# EasyEDA Pro project ProPrj_H750VB_2024-10-16.epro, board PCB1
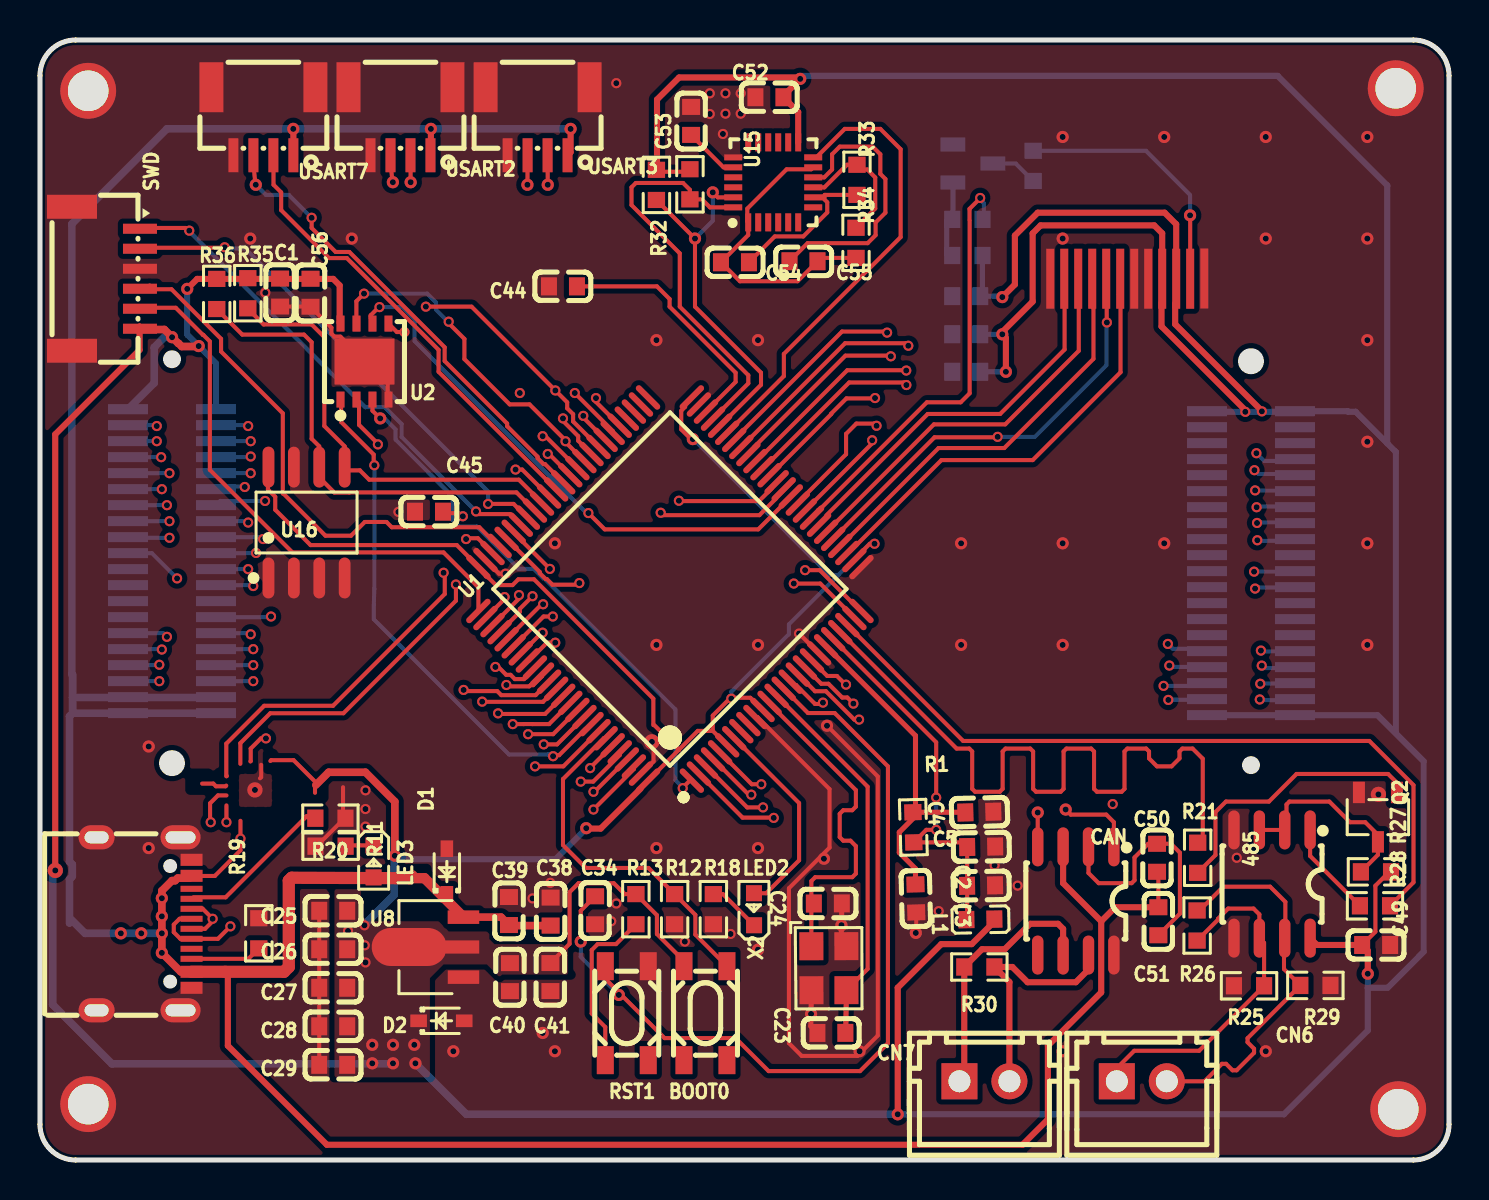
[diagram p2: board, top side]
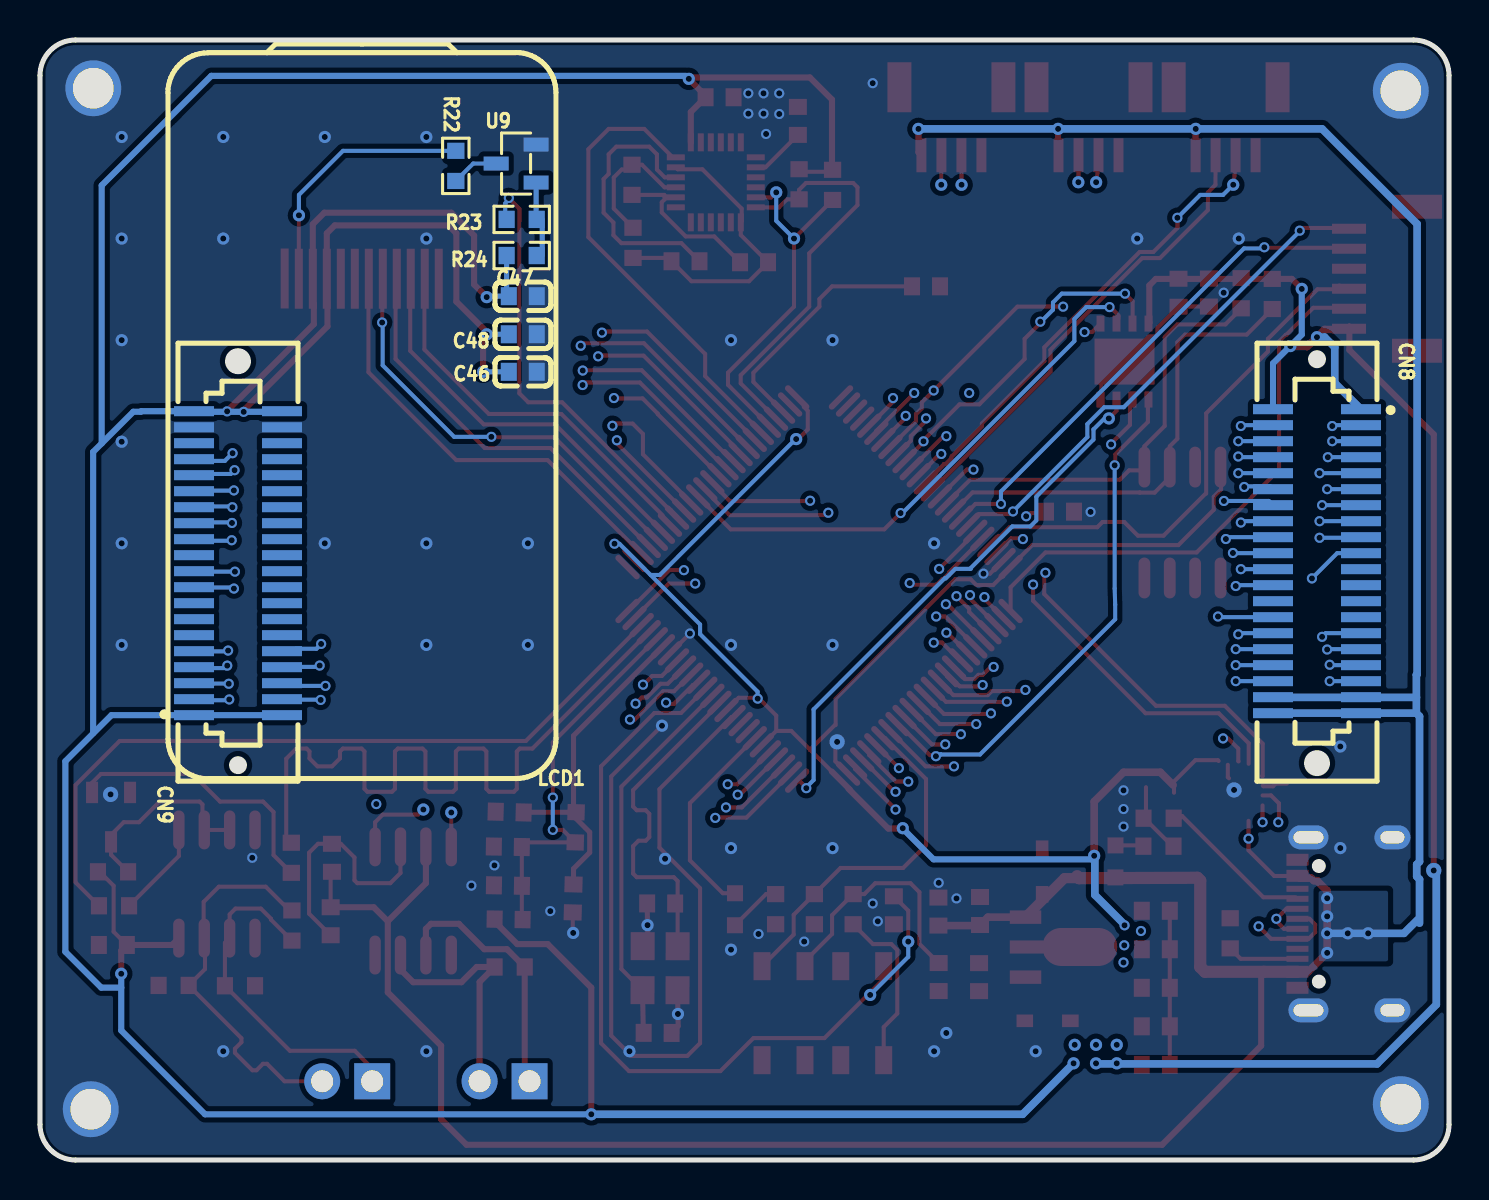
[diagram p3: board, bottom side, seen from below]

Outline 70.49 x 56.01 mm; copper layers: Top Layer, Inner1, Inner2, Bottom Layer. Coordinates in mm from the lower left corner of the outline.
Outline path: 0,54.23 0,1.78 arc(0.52,0.52) 1.78,0 68.71,0 arc(69.96,0.52) 70.49,1.78 70.49,54.23 arc(69.96,55.49) 68.71,56.01 1.78,56.01 arc(0.52,55.49) 0,54.23
Stack: Top Layer 0.035mm 外层铜厚1oz / Dielectric1 0.2104mm 7628 RC49% 8.6mil / Inner1 0.0152mm 内层铜厚 / Dielectric2 1.065mm 1.1mm H/HOZ Copper / Inner2 0.0152mm 内层铜厚 / Dielectric3 0.2104mm 7628 RC49% 8.6mil / Bottom Layer 0.035mm 外层铜厚1oz

## Design rules (mm)
template: 自定义配置
spacing copperThickness1oz (default): track to track 0.102, other pairs 0.152 to 0.3
spacing copperThickness2oz: track to track 0.203, other pairs 0.152 to 0.3
track width copperThickness1oz (default): min 0.127, default 0.203, max 2.54
track width copperThickness2oz: min 0.203, default 0.254, max 2.54
differential pair differentialPair (default): width min 0.127, default 0.254, max 2.54; gap min 0.152, default 0.152
via viaSize (default): diameter min 0.5, default 0.61, max 10; hole min 0.3, default 0.305, max 6.299
net 3.3V uses copperRegion1
net GND uses copperRegion1
net +5V uses copperRegion1

## Placement (name value [footprint] x y rotation side)
485  SP3485EN-L/TR  [SOIC-8_L5.0-W4.0-P1.27-LS6.0-BL]  61.63 13.8 180 top
BOOT0  TS-1145A-B-A  [SW-SMD_4P-L4.2-W3.2-P2.15-LS5.2]  33.29 7.34 180 top
C1  100nF  [C0603]  12.01 43.38 90 top
C2  100nF  [C0603]  47.08 15.66 181 top
C3  100nF  [C0603]  47.08 13.72 181 top
C4  100nF  [C0603]  46.99 17.4 181.5 top
C5  100nF  [C0603]  43.81 13.08 91.5 top
C23  22pf  [C0603]  39.59 6.36 0.1 top
C24  22pf  [C0603]  39.41 12.83 180.1 top
C25  100nF  [C0603]  14.67 12.46 0 top
C26  100nF  [C0603]  14.67 10.54 0 top
C27  100nF  [C0603]  14.67 8.61 0 top
C28  100nF  [C0603]  14.67 6.69 0 top
C29  4.7uF  [C0603]  14.67 4.76 0 top
C34  100nF  [C0603]  27.77 12.49 90 top
C38  100nF  [C0603]  25.54 12.42 270 top
C39  100nF  [C0603]  23.46 12.45 270 top
C40  100nF  [C0603]  23.51 9.15 90 top
C41  10uF  [C0603]  25.53 9.15 90 top
C44  2.2uF  [C0603]  26.16 43.69 0 top
C45  2.2uF  [C0603]  19.46 32.42 0 top
C46  100nF  [C0603]  46.33 39.42 0 bottom
C47  100nF  [C0603]  46.33 43.2 0 bottom
C48  100nF  [C0603]  46.33 41.29 0 bottom
C49  100nF  [C0603]  66.84 10.75 0 top
C50  100nF  [C0603]  55.88 15.11 90 top
C51  10uF  [C0603]  55.94 11.94 90 top
C52  100nF  [C0603]  36.49 53.14 0 top
C53  2.2nF  [C0603]  32.57 51.96 90 top
C54  100nF  [C0603]  34.76 44.89 180 top
C55  100nF  [C0603]  38.19 44.94 180 top
C56  100nF  [C0603]  13.53 43.37 90 top
CAN  TJA1050T/CM,118  [SOIC-8_L5.0-W4.0-P1.27-LS6.0-BL]  51.82 12.95 180 top
CN6  ZX-XH2.54-2PZZ  [CONN-TH_2P-P2.50_HX25003-2A]  55.12 3.94 0 top
CN7  ZX-XH2.54-2PZZ  [CONN-TH_2P-P2.50_HX25003-2A]  47.24 3.94 0 top
CN8  X0802WVS-40AS-LPV01  [CONN-SMD_40P-P0.80_XKB_X0802WVS-40ADS-LPV01]  6.6 29.95 270 bottom
CN9  X0802WVS-40AS-LPV01  [CONN-SMD_40P-P0.80_XKB_X0802WVS-40ADS-LPV01]  60.58 29.84 90 bottom
D1  CESD5V0D3  [SOD-323_L1.7-W1.3-LS2.6-RD-2]  20.35 14.43 90 top
D2  CESD5V0D3  [SOD-323_L1.7-W1.3-LS2.6-RD-2]  20.08 6.96 0 top
L1  BLM18SG331TN1D-300Ω100MHz  [L0603]  47.04 12.03 181 top
LCD1  1.47寸 IPS 172*320  [1.47LCD-IPS-172*320-反面]  54.36 43.82 0 bottom
LED2  -  [LED_0603]  35.71 12.59 90 top
LED3  -  [LED_0603]  16.69 14.88 270 top
NOREF  -  [Pad_e879]  2.41 2.79 0 top
NOREF#2  -  [Pad_e875]  67.94 2.54 0 top
NOREF#3  -  [Pad_e877]  67.82 53.59 0 top
NOREF#4  -  [Pad_e878]  2.41 53.47 0 top
Q2  S8050  [SOT-23-3_L2.9-W1.6-P1.90-LS2.8-BR]  66.93 17.15 90 top
R1  0  [R0603]  43.69 16.64 271.5 top
R11  10K  [R0603]  14.53 15.69 0 top
R12  10K  [R0603]  31.75 12.54 90 top
R13  10K  [R0603]  29.81 12.54 90 top
R18  10K  [R0603]  33.69 12.54 90 top
R19  5.1k  [R0603]  10.95 11.34 90 top
R20  5.1k  [R0603]  14.53 17.09 180 top
R21  5.1K  [R0603]  57.91 15.11 90 top
R22  20  [R0603]  49.68 49.71 90 bottom
R23  1K  [R0603]  46.39 47.04 180 bottom
R24  10K  [R0603]  46.39 45.23 180 bottom
R25  5.1K  [R0603]  60.48 8.71 0 top
R26  120  [R0603]  57.88 11.73 90 top
R27  5.1K  [R0603]  66.83 14.41 180 top
R28  1K  [R0603]  66.78 12.71 0 top
R29  5.1K  [R0603]  63.8 8.73 0 top
R30  120  [R0603]  46.99 9.65 0 top
R31  5.1k  [R0603]  32.51 48.79 90 top
R32  5.1k  [R0603]  30.84 48.76 90 top
R33  5.1k  [R0603]  40.87 49.02 270 top
R34  5.1k  [R0603]  40.82 45.86 270 top
R35  5.1k  [R0603]  10.4 43.34 270 top
R36  5.1k  [R0603]  8.84 43.31 270 top
RST1  TS-1145A-B-A  [SW-SMD_4P-L4.2-W3.2-P2.15-LS5.2]  29.35 7.34 180 top
SWD  swd  [CONN-SMD_6P-P1.00_MEGASTAR_ZX-SH1.0-6PWT]  3.3 44.07 270 top
U1  STM32H750VBT6  [LQFP-100_L14.0-W14.0-P0.50-LS16.0-BL]  31.51 28.55 45 top
U2  W25Q64JVXGIQ-QSPI  [XSON-8_L4.0-W4.0-P0.80-TL-EP]  16.23 39.93 90 top
U8  AMS1117-3.3  [SOT-89_L4.5-W2.5-P1.50-LS4.2-BR]  19.83 10.64 0 top
U9  SS8050  [SOT-23-3_L2.9-W1.3-P1.90-LS2.4-BR]  46.67 49.83 180 bottom
U15  MPU6050  [QFN-24_L4.0-W4.0-P0.50-BL]  36.68 48.89 0 top
U16  AT24C256C-SSHL-T  [SOIC-8_L4.9-W3.9-P1.27-LS6.0-BL]  13.33 31.88 0 top
USART2  WAFER-SH1.0-4PWB  [CONN-SMD_4P-P1.00_WAFER-SH1.0-4PWB]  18.03 51.94 180 top
USART3  WAFER-SH1.0-4PWB  [CONN-SMD_4P-P1.00_WAFER-SH1.0-4PWB]  24.89 51.94 180 top
USART7  WAFER-SH1.0-4PWB  [CONN-SMD_4P-P1.00_WAFER-SH1.0-4PWB]  11.18 51.94 180 top
USB1  TYPE-C 16PIN 2MD(073)  [USB-C-SMD_TYPE-C-6PIN-2MD-073]  5.21 11.81 270 top
X2  25MHz  [OSC-SMD_4P-L3.2-W2.5-BL]  39.47 9.59 270.1 top

## Footprints (pads in the part's own frame, mm; a bottom-side part is the same pattern mirrored in y, then rotated)
1.47LCD-IPS-172*320-反面
  rect 0.4x3 smd far side: 1(3.888,-0.266) 2(3.181,-0.254) 3(2.481,-0.254) 4(1.781,-0.254) 5(1.081,-0.254) 6(0.381,-0.254) 7(-0.319,-0.254) 8(-1.019,-0.254) 9(-1.719,-0.254) 10(-2.419,-0.254) 11(-3.119,-0.254) 12(-3.819,-0.254)
C0603
  rect 0.8x0.9 smd: 1(-0.7,0) 2(0.7,0)
CONN-SMD_4P-P1.00_WAFER-SH1.0-4PWB
  rect 0.5x1.7 smd: 1(-1.5,1.7) 2(-0.5,1.7) 3(0.5,1.7) 4(1.5,1.7)
  rect 1.2x2.5 smd: 5(-2.6,-1.7) 6(2.6,-1.7)
CONN-SMD_6P-P1.00_MEGASTAR_ZX-SH1.0-6PWT
  rect 0.5x1.7 smd: 1(-2.5,1.7) 2(-1.5,1.7) 3(-0.5,1.7) 4(0.5,1.7) 5(1.5,1.7) 6(2.5,1.7)
  rect 1.2x2.5 smd: 7(3.6,-1.7) 8(-3.6,-1.7)
CONN-SMD_40P-P0.80_XKB_X0802WVS-40ADS-LPV01
  rect 0.5x2 smd: 1(-7.6,2.2) 2(-7.6,-2.2) 3(-6.8,2.2) 4(-6.8,-2.2) 5(-6,2.2) 6(-6,-2.2) 7(-5.2,2.2) 8(-5.2,-2.2) 9(-4.4,2.2) 10(-4.4,-2.2) 11(-3.6,2.2) 12(-3.6,-2.2) 13(-2.8,2.2) 14(-2.8,-2.2) 15(-2,2.2) 16(-2,-2.2) 17(-1.2,2.2) 18(-1.2,-2.2) 19(-0.4,2.2) 20(-0.4,-2.2) 21(0.4,2.2) 22(0.4,-2.2) 23(1.2,2.2) 24(1.2,-2.2) 25(2,2.2) 26(2,-2.2) 27(2.8,2.2) 28(2.8,-2.2) 29(3.6,2.2) 30(3.6,-2.2) 31(4.4,2.2) 32(4.4,-2.2) 33(5.2,2.2) 34(5.2,-2.2) 35(6,2.2) 36(6,-2.2) 37(6.8,2.2) 38(6.8,-2.2) 39(7.6,2.2) 40(7.6,-2.2)
CONN-TH_2P-P2.50_HX25003-2A
  rect 1.8x1.8 hole 1.1: 1(-1.25,0)
  round 1.8 hole 1.1: 2(1.25,0)
L0603
  rect 0.8x0.864 smd: 1(-0.7,0) 2(0.7,0)
LED_0603
  rect 0.8x0.8 smd: 1(-0.851,-0.01) 2(0.75,-0.005)
LQFP-100_L14.0-W14.0-P0.50-LS16.0-BL
  oval 0.3x1.6 smd: 1(-6,-7.55) 2(-5.5,-7.55) 3(-5,-7.55) 4(-4.5,-7.55) 5(-4,-7.55) 6(-3.5,-7.55) 7(-3,-7.55) 8(-2.5,-7.55) 9(-2,-7.55) 10(-1.5,-7.55) 11(-1,-7.55) 12(-0.5,-7.55) 13(0,-7.55) 14(0.5,-7.55) 15(1,-7.55) 16(1.5,-7.55) 17(2,-7.55) 18(2.5,-7.55) 19(3,-7.55) 20(3.5,-7.55) 21(4,-7.55) 22(4.5,-7.55) 23(5,-7.55) 24(5.5,-7.55) 25(6,-7.55) 51(6,7.55) 52(5.5,7.55) 53(5,7.55) 54(4.5,7.55) 55(4,7.55) 56(3.5,7.55) 57(3,7.55) 58(2.5,7.55) 59(2,7.55) 60(1.5,7.55) 61(1,7.55) 62(0.5,7.55) 63(0,7.55) 64(-0.5,7.55) 65(-1,7.55) 66(-1.5,7.55) 67(-2,7.55) 68(-2.5,7.55) 69(-3,7.55) 70(-3.5,7.55) 71(-4,7.55) 72(-4.5,7.55) 73(-5,7.55) 74(-5.5,7.55) 75(-6,7.55)
  oval 1.6x0.3 smd: 26(7.55,-6) 27(7.55,-5.5) 28(7.55,-5) 29(7.55,-4.5) 30(7.55,-4) 31(7.55,-3.5) 32(7.55,-3) 33(7.55,-2.5) 34(7.55,-2) 35(7.55,-1.5) 36(7.55,-1) 37(7.55,-0.5) 38(7.55,0) 39(7.55,0.5) 40(7.55,1) 41(7.55,1.5) 42(7.55,2) 43(7.55,2.5) 44(7.55,3) 45(7.55,3.5) 46(7.55,4) 47(7.55,4.5) 48(7.55,5) 49(7.55,5.5) 50(7.55,6) 76(-7.55,6) 77(-7.55,5.5) 78(-7.55,5) 79(-7.55,4.5) 80(-7.55,4) 81(-7.55,3.5) 82(-7.55,3) 83(-7.55,2.5) 84(-7.55,2) 85(-7.55,1.5) 86(-7.55,1) 87(-7.55,0.5) 88(-7.55,0) 89(-7.55,-0.5) 90(-7.55,-1) 91(-7.55,-1.5) 92(-7.55,-2) 93(-7.55,-2.5) 94(-7.55,-3) 95(-7.55,-3.5) 96(-7.55,-4) 97(-7.55,-4.5) 98(-7.55,-5) 99(-7.55,-5.5) 100(-7.55,-6)
OSC-SMD_4P-L3.2-W2.5-BL
  rect 1.4x1.2 smd: 1(-1.1,-0.875) 2(1.1,-0.875) 3(1.1,0.875) 4(-1.1,0.875)
Pad_e875
  round 2.794 hole 2.032: 1(0,0)
Pad_e877
  round 2.794 hole 2.032: 1(0,0)
Pad_e878
  round 2.794 hole 2.032: 1(0,0)
Pad_e879
  round 2.794 hole 2.032: 1(0,0)
QFN-24_L4.0-W4.0-P0.50-BL
  rect 0.3x0.9 smd: 1(-1.25,-2) 2(-0.75,-2) 3(-0.25,-2) 4(0.25,-2) 5(0.75,-2) 6(1.25,-2) 13(1.25,2) 14(0.75,2) 15(0.25,2) 16(-0.25,2) 17(-0.75,2) 18(-1.25,2)
  rect 0.9x0.3 smd: 7(2,-1.25) 8(2,-0.75) 9(2,-0.25) 10(2,0.25) 11(2,0.75) 12(2,1.25) 19(-2,1.25) 20(-2,0.75) 21(-2,0.25) 22(-2,-0.25) 23(-2,-0.75) 24(-2,-1.25)
R0603
  rect 0.806x0.864 smd: 1(-0.753,0) 2(0.753,0)
SOD-323_L1.7-W1.3-LS2.6-RD-2
  rect 0.83x0.63 smd: 1(-1.14,0) 2(1.14,0)
SOIC-8_L4.9-W3.9-P1.27-LS6.0-BL
  oval 0.588x2.045 smd: 1(-1.905,-2.772) 2(-0.635,-2.772) 3(0.635,-2.772) 4(1.905,-2.772) 5(1.905,2.772) 6(0.635,2.772) 7(-0.635,2.772) 8(-1.905,2.772)
SOIC-8_L5.0-W4.0-P1.27-LS6.0-BL
  oval 0.569x1.95 smd: 1(-1.905,-2.705) 2(-0.635,-2.705) 3(0.635,-2.705) 4(1.905,-2.705) 5(1.905,2.705) 6(0.635,2.705) 7(-0.635,2.705) 8(-1.905,2.705)
SOT-23-3_L2.9-W1.3-P1.90-LS2.4-BR
  rect 1.25x0.7 smd: 1(1,-0.95) 2(1,0.95) 3(-1,0)
SOT-23-3_L2.9-W1.6-P1.90-LS2.8-BR
  rect 1.07x0.6 smd: 1(1.235,-0.95) 2(1.235,0.95) 3(-1.235,0)
SOT-89_L4.5-W2.5-P1.50-LS4.2-BR
  rect 1.575x0.672 smd: 1(1.356,-1.5) 3(1.356,1.5)
  custom 5.377x1.9 smd: 2(-1.356,0.009)
SW-SMD_4P-L4.2-W3.2-P2.15-LS5.2
  rect 0.85x1.4 smd: 1(1.075,2.35) 2(1.075,-2.35) 3(-1.075,2.35) 4(-1.075,-2.35)
USB-C-SMD_TYPE-C-6PIN-2MD-073
  rect 0.6x1.1 smd: 1(-3.2,2.375) 2(-2.4,2.375) 11(2.4,2.375) 12(3.2,2.375)
  rect 0.3x1.1 smd: 3(-1.75,2.375) 4(-1.25,2.375) 5(-0.75,2.375) 6(-0.25,2.375) 7(0.25,2.375) 8(0.75,2.375) 9(1.25,2.375) 10(1.75,2.375)
  oval 1.2x2 hole 0.6x1.5: 13(-4.325,1.825) 14(4.325,1.825)
  oval 1.2x1.8 hole 0.6x1.2: 13(-4.325,-2.375) 14(4.325,-2.375)
XSON-8_L4.0-W4.0-P0.80-TL-EP
  rect 0.8x0.4 smd: 1(-1.9,1.2) 2(-1.9,0.4) 3(-1.9,-0.4) 4(-1.9,-1.2) 5(1.9,-1.2) 6(1.9,-0.4) 7(1.9,0.4) 8(1.9,1.2)
  rect 2.3x3 smd: 9(0,0)

## Nets
As in the schematic, except:
GND: 485.4 485.5 C1.1 C2.1 C3.1 C4.1 C5.1 C23.1 C24.1 C25.1 C26.1 C27.1 C28.1 C29.1 C34.1 C38.1 C39.1 C40.1 C41.1 C44.1 C45.1 C46.1 C47.1 C48.1 C49.2 C52.1 C53.2 C56.1 CAN.8 CN9.37 CN9.38 D1.2 D2.2 LCD1.1 LCD1.5 LCD1.6 LCD1.12 NOREF.1 NOREF#2.1 NOREF#3.1 NOREF#4.1 Q2.2 R11.1 R12.1 R18.1 R19.2 R20.1 R25.1 R29.2 RST1.4 SWD.3 SWD.7 SWD.8 U1.10 U1.19 U1.26 U1.49 U1.74 U1.99 U2.4 U2.9 U8.1 U9.2 U15.19 U16.1 U16.2 U16.3 U16.4 U16.7 USART2.4 USART2.5 USART2.6 USART3.4 USART3.5 USART3.6 USART7.4 USART7.5 USART7.6 USB1.1 USB1.12 USB1.13 USB1.14 X2.2 X2.4
CAN_RX: CAN.4 U1.70 USB1.5 USB1.7
CAN_TX: CAN.1 U1.71 USB1.6 USB1.8

Pads without a net: BOOT0 1 3; CAN 5; RST1 3; U15 2 3 4 5 6 7 14 15 16 17 18 21 22; USB1 3 9

## Via types
v1: diameter 0.61, hole 0.305, Top Layer to Bottom Layer, 79 vias
v2: diameter 0.508, hole 0.305, Top Layer to Bottom Layer, 161 vias
v3: diameter 0.762, hole 0.305, Top Layer to Bottom Layer, 4 vias

## Routing (per net, layer and track width the routed paths; a pad name or vN(x,y) marks a point on that pad's centre or on a via; arc(x,y) is an arc through that point)
3.3V: length 413.5
  Top Layer w0.203: 21.64,29.96 20.85,30.75 13.54,30.75 11.77,32.52 11.77,33.17 11.4,33.53 11.4,34.43 ; U1.6 33.66,21.46 ; 33.66,21.46 33.66,22.23 34.54,23.11 35.53,23.11 U1.11 ; 33.66,21.46 32.9,21.46 31.96,20.51 ; 11.53,19.95 11.57,19.99 12.69,19.99 13.76,18.92 ; 31.96,20.51 31.97,20.51 ; 31.96,20.51 U1.100 ; 31.96,20.51 30.7,21.77 ; 32.27,37.75 32.27,37.66 32.08,37.47 32.08,36.53 32.56,36.05 ; 30.68,21.75 30.68,23.07 24.71,29.04 23.93,29.04 23.64,28.75 22.81,28.75 22.37,29.18 22.3,29.18 ; 4.99,41.73 4.99,41.61 ; 30.86,49.42 32.58,49.42 32.61,49.39 ; C49.1 66.8,11.42 66.8,13.72 67.5,14.41 R27.1 ; 41.12,30.42 41.51,30.82 v2(41.75,30.82) ; 38,54.03 38.06,53.97 ; BOOT0.2 32.22,9.95 30.86,11.3 30.86,12.24 R13.2 29.25,13.3 28.7,13.84 26.94,13.84 26.49,13.39 26.49,10.81 25.53,9.85 ; 13.76,18.37 13.76,18.75 ; 4.98,41.53 4.98,41.73
  Top Layer w0.305: C52.2 37.93,52.41 37.93,50.89 ; v1(42.91,2.29) 42.91,8.62 45.09,10.8 46.61,10.8 47.74,11.93 L1.1 ; v1(48.14,43.15) 48.77,43.78 48.77,46.23 49.91,47.37 56.26,47.37 56.84,46.8 LCD1.3 ; v3(0.77,14.48) 0.76,14.48 0.76,36.29 4.98,40.51 4.98,41.53 ; 30.04,18.57 28.05,16.57 27.27,16.57 ; 30.87,49.6 30.87,53.03 31.97,54.13 37.89,54.13 38,54.03 37.42,53.44 37.41,53.44 ; v1(7.37,43.56) 7.87,44.06 R36.1 14.67,44.06 14.99,43.73 14.99,41.87 U2.8 ; v1(48.32,39.42) 48.32,41.11 v1(48.14,41.29) 48.14,41.41 49.66,42.93 49.66,46.34 50.05,46.74 55.74,46.74 56.14,46.34 LCD1.4 ; 485.8 63.88,10.75 C49.1 66.42,10.47 v1(66.42,9.31) ; 61.13,37.45 56.79,41.79 56.79,42.83 ; 56.1,42.84 56.1,41.68 60.34,37.44
  Top Layer w0.381: v1(7.94,40.7) 7.92,40.68 7.09,40.68 6.93,40.84 6.91,40.84 v1(6.61,41.15) 6.22,41.53 4.87,41.53 ; v1(17.75,15.21) 17.75,17.92 16.28,19.39 14.44,19.39 13.8,18.75
  Bottom Layer w0.203: v2(41.75,30.82) 41.5,30.82 37.47,26.78 37.47,26.3 34.59,23.42 34.59,23.02 ; 39.93,29.25 39.48,29.25 32.74,35.99
  Bottom Layer w0.254: R24.1 47.14,43.31 C47.2 ; v1(48.14,41.29) 48.14,41.29 47.16,41.29 ; v1(48.14,43.15) 48.09,43.2 47.16,43.2 ; 47.16,39.42 v1(48.32,39.42)
  Bottom Layer w0.305: 66.42,8.62 67.42,8.62 69.22,10.41 69.22,19.94 66.91,22.25 CN9.1 CN9.2 ; 66.42,8.62 v1(66.42,9.31) ; 66.42,8.62 66.42,6.48 62.23,2.29 v1(42.91,2.29) ; 17.85,15.07 17.89,15.04 25.79,15.04 27.29,16.54 ; v1(7.37,43.56) 7.37,41.28 v1(7.94,40.7) 8.8,39.84 CN8.2 ; 67.4,35.84 65.82,37.42 65.44,37.42 65.41,37.45 63.34,37.45 ; 67.4,35.84 67.4,48.73 61.92,54.21 38.17,54.21 ; 67.4,35.84 67.83,35.41 67.83,21.34 ; 62.45,37.38 62.42,37.42 59.08,37.42 ; 38.21,54.17 38.05,54.01
  Bottom Layer w0.381: 16.25,11.78 17.72,13.26 17.72,15.26 ; CN8.1 5.72,38.86 5.72,40.64 6.22,41.15 6.35,41.15 ; v1(42.91,2.29) 21.33,2.29 v1(18.78,4.83) ; 17.67,4.81 3.6,4.81 0.64,7.77 0.64,14.35 v3(0.77,14.48)
  vias: v1(16.62,5.76) v1(16.62,4.83) v1(17.66,5.76) v1(17.66,4.83) v1(18.72,5.76) v1(27.33,16.59) v1(32.66,36.05) v1(38.03,54.06) v2(15.41,11.45) v2(16.23,11.74) v2(16.25,10.74) v2(16.28,9.88) v2(34.58,23.07) v2(60.29,37.41) v2(61.12,37.44)
+5V: length 194.8
  Top Layer w0.203: 10.03,16.96 v2(10.03,16.07) 10.03,15.49 8.75,14.2 7.76,14.2 ; 10.53,19.93 10.54,19.95 10.54,20.57 11.05,21.08 v2(11.3,21.08) ; C50.1 55.94,14.35 C51.2
  Top Layer w0.305: C51.2 53.79,12.64 53.09,11.94 ; USART2.1 19.56,50.26 v1(19.56,51.56) ; 53.09,11.94 51.18,13.84 CAN.3 ; 53.09,11.94 53.09,8.38 50.42,5.72 50.42,2.03 49.15,0.76 14.35,0.76 9.4,5.72 9.4,9.28 9.27,9.41 ; USART7.1 12.68,51.56 v1(12.67,51.56) ; USART3.1 26.54,50.39 v1(26.54,51.56)
  Top Layer w0.381: C38.2 23.49,11.72 C39.2 23.07,12.14 21.18,12.14 ; USB1.2 7.47,14.1 6.89,14.1 6.76,13.97 6.6,13.97 6.1,13.46 v1(6.1,13.09) v1(6.1,12.18) v1(6.1,11.34) v1(6.1,10.36) 7.04,9.41 USB1.11
  Top Layer w0.508: 18.6,14.09 19.24,14.09 21.18,12.14
  Top Layer w0.61: 18.6,14.19 18.5,14.09 12.59,14.11 12.45,13.97 12.45,9.65 12.2,9.41 USB1.11
  Inner1 w0.203: v2(11.3,21.08) 11.39,21 11.39,17.43 v2(10.03,16.07)
  Bottom Layer w0.381: 1.48,11.84 1.48,14.04 1.62,14.18 1.62,14.78 1.48,14.92 1.48,22.19 1.63,22.34 ; v1(6.1,11.34) v1(5.07,11.34) v1(4.05,11.34) 2.25,11.34 1.59,12 ; 1.63,22.34 CN8.39 CN8.40 ; 1.63,22.34 1.63,23.13 ; 1.63,23.13 1.63,24.26 1.62,24.28 ; 1.63,23.13 8.79,23.13 CN8.38 ; 1.6,24.28 1.6,46.81 6.35,51.56 v1(12.67,51.56) v1(19.56,51.56) v1(26.54,51.56)
GND: length 71
  Top Layer w0.203: 37.96,26.3 38,26.3 38.84,25.46 ; 35.79,22.15 35.89,22.15 39.5,18.55 39.5,15.62 37.47,13.59 37.47,5.84 38.1,5.21 40.89,5.21 41.91,6.22 41.91,19.18 v1(39.37,21.72) ; 22.66,29.62 22.96,29.32 v2(23.29,29.32) ; 43.83,12.38 43.83,11.18 ; 11.06,19.76 11.06,19.15 11.01,19.09 ; 12.01,42.68 13.52,42.68 C56.1 14.58,41.62 14.58,41.32 14.73,41.17 15.03,41.17 16.23,39.97 U2.9 ; 30.5,19.74 30.7,19.93 30.7,20.83 ; 17.4,38.12 17.4,39.09 17.48,39.18 ; C29.1 C28.1 C27.1 C26.1 C25.1 ; 13.89,15.74 15.16,17.01 ; 15.16,17.01 15.16,16.99 15.28,16.87 ; 15.16,17.01 15.16,18.64
  Top Layer w0.254: X2.4 40.08,10.96 v1(40.09,11.74) C24.1 ; X2.2 v1(38.57,7.3) 38.56,6.69 38.89,6.35
  Inner1 w0.203: v1(10.52,46.08) 11.27,45.32 v2(11.27,43.37)
  vias: v1(5.44,20.68) v1(5.44,15.6) v1(15.6,46.08) v1(20.68,5.44) v1(25.15,6.35) v1(25.76,30.84) v1(25.76,5.44) v1(30.84,41) v1(30.84,25.76) v1(30.84,15.6) v1(35.92,41) v1(35.92,25.76) v1(35.92,15.6) v1(35.92,10.52) v1(39.22,15.06) v1(41,5.44) v1(43.81,11.36) v1(46.08,30.84) v1(46.08,25.76) v1(51.16,51.16) v1(51.16,46.08) v1(51.16,30.84) v1(51.16,25.76) v1(51.16,5.44) v1(56.24,51.16) v1(56.24,30.84) v1(61.32,51.16) v1(61.32,46.08) v1(61.32,5.44) v1(66.4,51.16) v1(66.4,46.08) v1(66.4,41) v1(66.4,35.92) v1(66.4,30.84) v1(66.4,25.76) v2(16.28,18.48) v2(16.28,17.55) v2(16.28,16.67) v2(17.93,32.41) v2(24.64,13.08) v2(25.53,13.86) v2(28.57,11.94) v2(28.83,53.85) v2(28.83,12.83) v2(32.26,10.92) v2(33.51,53.34) v2(33.51,52.31) v2(34.16,51.31) v2(34.29,53.34) v2(34.29,52.32) v2(34.54,11.3) v2(35.05,53.34) v2(35.05,52.32) v2(37.97,26.33) v2(44.96,12.45) v2(47.75,14.73) v2(48.9,13.72) v2(59.87,15.11) v3(10.75,18.51) v3(30.61,20.91) v3(66.95,18.28)
VDDA: length 19.5
  Top Layer w0.203: L1.2 46.38,12.06 C2.2 46.15,15.88 R1.2 44.33,16.51 v2(44.83,16.51) ; v2(44.83,18.12) 44.83,20.89 U1.21
  Bottom Layer w0.203: v2(44.83,16.51) v2(44.83,18.12)
485_UART4_RX: length 38.2
  Top Layer w0.203: U1.23 46.18,20.95 66.5,20.95 68.71,18.75 68.71,13.88 R28.2
485_UART4_TX: length 38.1
  Top Layer w0.203: R21.2 58.17,16.12 58.17,20.07 57.66,20.57 57.15,20.57 57,20.43 57,20.08 56.61,19.69 55.88,19.69 55.48,20.08 55.48,20.43 55.34,20.57 54.4,20.57 54.25,20.43 54.25,18.56 54.11,18.42 52.87,18.42 52.73,18.56 52.73,20.43 52.58,20.57 51.35,20.57 51.2,20.43 51.2,18.56 51.06,18.42 49.82,18.42 49.68,18.56 49.68,20.43 49.54,20.57 48.3,20.57 48.16,20.43 48.16,18.56 48.01,18.42 46.78,18.42 46.63,18.56 46.63,20.43 46.49,20.57 45.85,20.57 U1.22
BLK: length 21.1
  Top Layer w0.203: 47.01,48.07 46.5,47.56 46.5,47.01 ; 46.51,46.96 46.51,38.34 46.06,37.89 44.37,37.89 38.98,32.5 38.92,32.5
  Bottom Layer w0.203: 46.98,48.07 47.21,47.84 47.21,46.96
  vias: v2(47.03,48.11)
BOOT0: length 17.6
  Top Layer w0.203: BOOT0.4 32.78,11.27 32.78,12.26 R12.2 30.44,14.61 27.31,14.61 26.16,15.75 26.16,19.05 28.2,21.09 U1.94
CAN_RX: length 42.3
  Top Layer w0.203: 25.55,29.55 25.51,29.55 24.08,30.98 ; USB1.7 8.26,11.56 8.64,11.94 v2(8.64,12.06) 8.64,12.07 8.13,12.57 7.59,12.57 USB1.5 ; CAN.4 v1(49.91,17.38) ; 9.33,17.73 v2(9.33,16.89)
  Inner1 w0.203: v2(9.33,16.89) 9.33,12.75 v2(8.64,12.06) ; v1(49.91,17.38) 49.91,18.16 40.27,27.8 27.13,27.8 25.47,29.47
  vias: v2(25.51,29.56)
CAN_TX: length 49.1
  Top Layer w0.203: v2(8.54,16.89) 8.51,16.92 8.51,17.84 8.9,18.23 9.33,18.23 ; v2(9.53,11.68) 8.9,11.06 USB1.8 7.02,11.06 6.69,11.39 6.69,11.77 6.98,12.07 7.58,12.07 USB1.6 ; 23.8,30.61 25,29.41 25,29.35 25.3,29.05 25.35,29.05 25.63,28.77 27.03,28.77 ; v1(51.31,17.53) 51.56,17.27 53.34,17.27 53.72,16.89 CAN.1
  Inner1 w0.203: 26.99,28.85 27.52,28.32 40.52,28.32 v1(51.31,17.53)
  Inner2 w0.203: v2(9.53,11.68) 9.53,14.1 8.51,15.11 8.51,16.86 v2(8.54,16.89)
  vias: v2(26.98,28.85)
CS: length 19.9
  Top Layer w0.203: 53.33,42.81 53.36,42.78 53.36,41.92 ; v2(47.91,36.16) 47.88,36.14 44.75,36.14 40.06,31.45
  Bottom Layer w0.203: 53.34,41.98 53.34,39.74 49.77,36.16 v2(47.91,36.16)
  vias: v2(53.37,41.88)
DC: length 21.2
  Top Layer w0.203: 40.52,30.43 45.09,35 49.66,35 54.05,39.39 54.05,43.19 53.96,43.28
LEDK: length 13
  Top Layer w0.203: v1(57.53,47.24) 57.54,47.23 LCD1.2
  Bottom Layer w0.203: R22.2 55.33,50.46 57.53,48.26 v1(57.53,47.24)
LPUART1_RX: length 46
  Top Layer w0.203: v2(21.81,32.43) 21.94,32.3 23.51,32.3 23.91,31.9 ; 9.34,19.2 9.33,19.19 9.32,19.19 ; 5.11,46.61 7.29,46.61 7.45,46.45 ; v2(20.19,29.37) 20.25,29.31 20.25,28.3 14.66,22.71 11.21,22.71 9.32,20.82 9.32,19.27
  Inner2 w0.203: 20.15,29.4 20.15,30.77 21.07,31.68 21.36,31.68 21.66,31.98 21.66,32.28 21.87,32.49
  Bottom Layer w0.203: 7.49,46.42 16.27,37.64 17.25,37.64 18.09,36.8 18.09,36.15 v2(21.81,32.43) ; 7.48,46.42 7.44,46.39
  vias: v2(7.47,46.47)
LPUART1_TX: length 44.6
  Top Layer w0.203: v2(20.81,28.78) 20.81,27.97 15.18,22.34 11.52,22.34 10.02,20.84 10.02,19.81 ; 9.26,45.64 9.24,45.62 5.68,45.62 ; v2(22.41,32.81) 23.69,32.81 24.06,32.44
  Inner2 w0.203: 20.82,28.78 20.89,28.85 20.89,29.91 22.41,31.43 22.41,32.85
  Bottom Layer w0.203: 9.21,45.58 10.26,45.58 22.41,33.43 22.41,32.81
  vias: v2(9.24,45.64)
OSC_IN: length 17.1
  Top Layer w0.203: U1.12 36.5,22.81 40.81,18.5 40.81,17.67 40.63,17.49 40.18,17.49 40,17.31 40,16.15 40.18,15.97 40.54,15.97 40.81,15.7 40.81,14.32 40.63,14.14 38.78,14.14 38.59,13.95 X2.1
OSC_OUT: length 19.2
  Top Layer w0.203: X2.3 41.4,9.55 41.4,18.67 36.86,23.21
  Top Layer w0.254: X2.3 40.31,6.37 C23.2 ; 36.86,23.21 U1.13
PA2: length 33.2
  Top Layer w0.203: 40.47,27.35 40.47,27.39 39.03,28.83 v2(37.71,28.83) ; 17.53,50.24 arc(17.56,49.57) v1(17.65,48.9)
  Inner1 w0.203: 17.69,48.77 17.58,48.88 ; 17.74,48.82 17.85,48.82 17.94,48.73 17.94,48.7 18.31,48.34 18.32,48.34 37.69,28.96 37.83,28.96
PA3: length 32.4
  Top Layer w0.203: v2(38.27,29.5) 39.01,29.5 40.76,27.74 ; USART2.2 v1(18.54,48.9)
  Inner1 w0.203: 19.27,48.34 19.28,48.34 18.61,49 18.38,49 ; 19.28,48.33 22.07,45.74 38.25,29.55
PA5: length 18.7
  Top Layer w0.203: 40.45,31.1 44.95,35.6 48.24,35.6 52.7,40.06 52.7,42.6 52.56,42.74
PA7: length 18.1
  Top Layer w0.203: 39.68,31.75 44.72,36.79 48.29,36.79 51.96,40.46 51.96,42.66
PA8: length 23.2
  Top Layer w0.203: R36.2 10.12,41.28 13.21,41.28 13.59,40.89 13.59,36.07 13.97,35.69 U16.6 ; 13.81,34.29 14.73,33.37 15.47,33.37 15.48,33.38 23.84,33.38 24.51,32.71
PA13: length 25.7
  Top Layer w0.203: 12.2,33.3 14.28,31.22 15.56,31.22 16.25,31.9 17.33,31.9 17.6,31.64 21.98,31.64 22.69,30.93 ; 5.49,43.73 5.67,43.54 6.58,43.54 9.06,41.06 9.06,40.43 ; 12.15,33.32 12.15,37.34 9.06,40.43
PA14: length 27.1
  Top Layer w0.203: 5.55,42.62 6.79,42.62 8.15,41.26 8.17,41.26 8.5,40.93 8.5,34.51 12.63,30.38 20.19,30.38 21.93,28.64 U1.76
PA15: length 23.6
  Top Layer w0.203: U1.77 23.24,28.06 v2(23.24,28.15)
  Inner2 w0.203: v2(23.24,28.15) 21.38,26.29 19.94,26.29 16.89,23.24 9.27,23.24 v2(6.35,26.16)
  Bottom Layer w0.203: CN8.29 6.17,26.34 v2(6.35,26.16)
PB0: length 28
  Top Layer w0.203: v2(41.63,35.99) 41.63,35.84 38.73,32.94
  Inner1 w0.203: 60.78,28.65 59.91,28.65 54.64,33.92 47.17,33.92 45.08,36.01 41.71,36.01
  Bottom Layer w0.203: 60.81,28.57 60.86,28.63 62.37,28.63
  vias: v2(60.78,28.58)
PB1: length 29.6
  Top Layer w0.203: 38.1,33.06 40.32,35.29 40.32,36.31 40.84,36.83 41.74,36.83 v2(41.85,36.72)
  Inner1 w0.203: v2(60.73,29.42) 60.34,29.42 54.94,34.82 47.28,34.82 45.35,36.75 41.82,36.75
  Bottom Layer w0.203: 62.38,29.39 62.35,29.42 v2(60.73,29.42)
PB2: length 26.6
  Top Layer w0.203: v2(27.43,32.35) 28.25,31.54 35.93,31.54 37.17,32.77 ; 16.95,42.58 16.89,42.58 16.54,42.24 16.54,42.09
  Bottom Layer w0.203: 17.04,42.65 18.14,42.65 18.74,42.05 18.74,40.95 27.34,32.35 v2(27.43,32.35)
  vias: v2(16.98,42.65)
PB3: length 21.7
  Top Layer w0.203: v2(23.65,21.8) 24.2,21.8 24.21,21.8 24.63,21.8 24.63,21.8 25.47,21.8 U1.89
  Inner1 w0.203: v2(23.65,21.8) 20.11,21.8 11.55,30.36 v2(10.81,30.36)
  Bottom Layer w0.203: CN8.20 10.8,30.34
PB4: length 22
  Top Layer w0.203: v2(24.42,21.29) 25.67,21.29 U1.90
  Inner1 w0.203: v2(10.41,29.55) 11.48,29.55 19.73,21.29 24.41,21.29 v2(24.42,21.29)
  Bottom Layer w0.203: CN8.22 v2(10.41,29.55)
PB5: length 22.6
  Top Layer w0.203: U1.91 25.87,20.79 v2(25.2,20.79)
  Inner1 w0.203: v2(25.2,20.79) 24.86,20.45 19.81,20.45 12.32,27.94 11.43,27.94 v2(10.67,28.7)
  Bottom Layer w0.203: CN8.24 10.62,28.75 v2(10.67,28.7)
PB6: length 25.5
  Top Layer w0.203: v2(16.73,34.74) 16.69,34.77 16.69,35.28 15.06,36.91 15.06,38.1 ; 25.72,20.24 25.97,20.24 27.29,21.56
  Bottom Layer w0.203: 25.57,20.28 25.42,20.28 25.41,20.28 23.46,20.28 16.7,27.04 16.7,27.77 16.73,28.57 v2(16.73,34.74)
  vias: v2(25.67,20.19)
PB7: length 23
  Top Layer w0.203: v2(24.76,19.69) 26.18,19.69 U1.93
  Inner1 w0.203: v2(11.56,27.18) 12.32,27.18 19.81,19.69 v2(24.76,19.69)
  Bottom Layer w0.203: v2(11.56,27.18) 11.52,27.15 CN8.28
PB8: length 23.6
  Top Layer w0.203: U1.95 27.52,19.61 v2(27.52,19.6)
  Inner1 w0.203: v2(27.52,19.6) 27.01,19.6 26.46,19.05 19.69,19.05 12.45,26.29 v2(10.54,26.29)
  Bottom Layer w0.203: CN8.30 10.48,26.34 v2(10.54,26.29)
PB9: length 23.9
  Top Layer w0.203: v2(27.05,18.92) 27.68,18.92 29,20.25 29,20.38
  Inner1 w0.203: v2(27.05,18.92) 26.67,18.54 19.43,18.54 12.43,25.55 v2(10.67,25.55)
  Bottom Layer w0.203: CN8.32 v2(10.67,25.55)
PB10: length 18.1
  Top Layer w0.203: U15.23 33.9,48.14 v1(33.66,48.39) ; U1.46 36.07,38.76 36.07,39.37 32.77,42.67 v1(32.77,46.08) R32.1
  Bottom Layer w0.203: v1(33.66,48.39) 33.66,46.97 v1(32.77,46.08)
PB11: length 20.7
  Top Layer w0.203: U1.47 35.43,38.84 35.43,39.24 32,42.67 32,45.34 29.59,47.75 29.59,48.64 29.81,48.86 32.17,48.86 32.51,48.51 32.51,48.04 33.12,48.04 33.51,47.64 U15.24
PC0: length 26.9
  Top Layer w0.203: 39.17,22.8 38.77,22.8 37.82,23.75 37.79,23.75
  Inner2 w0.203: 39.22,22.94 40.74,21.41 52.9,21.41 55.71,24.22 60.41,24.22 60.86,24.66 61.16,24.66
  Bottom Layer w0.203: 62.31,24.6 61.18,24.6 61.11,24.66
  vias: v2(39.17,22.87) v2(61.12,24.72)
PC1: length 21.7
  Top Layer w0.203: v2(40.97,22.02) 40.73,22.02 39.32,23.44 38.77,23.44 38.36,23.85
  Inner2 w0.203: 56.42,24.64 55.11,24.64 52.57,22.11 41.14,22.11 40.99,21.96
  Bottom Layer w0.203: 58.19,24.66 56.52,24.66 56.45,24.72
  vias: v2(56.49,24.73)
PC2: length 25.2
  Top Layer w0.203: 38.71,24.19 39.08,23.81 39.44,23.81 40.13,23.13 40.39,23.13 v2(40.69,22.82)
  Inner2 w0.203: 61.26,25.25 54.99,25.25 52.57,22.83 40.75,22.83
  Bottom Layer w0.203: 61.1,25.43 62.24,25.43 62.27,25.41
  vias: v2(61.07,25.47)
PC3: length 20
  Top Layer w0.203: 39.02,24.63 39.02,24.56 39.38,24.2 39.87,24.2 40.3,23.77
  Inner2 w0.203: 40.33,23.78 52.26,23.78 54.21,25.73 56.35,25.73 v2(56.42,25.81)
  Bottom Layer w0.203: 57.7,25.56 56.66,25.56 56.42,25.8 v2(56.42,25.81)
  vias: v2(40.32,23.77)
PC4: length 17.6
  Top Layer w0.203: 39.33,32.23 44.41,37.31 48.03,37.31 51.25,40.53 51.25,42.81
PC6: length 23.8
  Top Layer w0.203: U1.63 25.26,34.8 25.19,34.8 24.89,35.1 24.89,35.17 23.37,36.7 23.37,36.83 20.24,39.95 20.24,40.64 15.48,45.41 14.79,45.41 13.59,46.61 v2(13.59,47.12) ; USART7.3 arc(10.71,49.5) v1(10.8,48.77)
  Bottom Layer w0.203: v2(13.59,47.12) 12.45,48.26 11.3,48.26 v1(10.8,48.77)
PC7: length 23.1
  Top Layer w0.203: 25.82,33.54 19.94,39.42 19.94,40.51 15.35,45.1 14.46,45.1 12.06,47.5 12.06,48.39 11.68,48.77 USART7.2
PC8: length 25.4
  Top Layer w0.203: U1.65 24.12,34.53 v2(23.79,34.53)
  Inner2 w0.203: v2(23.79,34.53) 22.7,34.53 15.98,27.81 8.13,27.81 v2(6.86,29.08)
  Bottom Layer w0.203: v2(6.86,29.08) 5.6,30.34 CN8.19
PC9: length 21.5
  Top Layer w0.203: 15.14,34.49 16,34.49 16.47,34.02 23.96,34.02 24.83,33.14 ; 10.67,42.55 10.67,42.3 11.19,41.78 13.59,41.78 14.22,41.15 14.22,36.7 15.24,35.69 U16.5
PC10: length 25.1
  Top Layer w0.203: 22.64,26.75 23.96,28.07 v2(23.96,28.25)
  Inner2 w0.203: v2(6.1,25.53) 8.89,22.73 17.14,22.73 20.32,25.91 21.72,25.91 23.96,28.15 v2(23.96,28.25)
  Bottom Layer w0.203: CN8.31 6.08,25.55 v2(6.1,25.53)
PC11: length 26.2
  Top Layer w0.203: v2(24.64,28.19) 24,27.56 24,27.41 U1.79
  Inner2 w0.203: v2(5.97,24.77) 8.51,22.23 17.65,22.23 20.96,25.53 21.97,25.53 v2(24.64,28.19)
  Bottom Layer w0.203: CN8.33 5.95,24.75 v2(5.97,24.77)
PC12: length 26.9
  Top Layer w0.203: U1.80 25.09,27.79 v2(25.17,27.79)
  Inner2 w0.203: v2(25.17,27.79) 25.12,27.79 22.35,25.02 21.34,25.02 18.03,21.72 8,21.72 5.97,23.75 v2(5.97,23.95)
  Bottom Layer w0.203: CN8.35 v2(5.97,23.95)
PC13: length 10.4
  Top Layer w0.203: U1.7 37.97,17.85 37.97,14.99 36.33,13.34 LED2.2
PD0: length 24.2
  Top Layer w0.203: U1.81 25.19,27.18 v2(25.65,27.18)
  Inner1 w0.203: v2(10.41,36.7) 11.43,36.7 21.97,26.16 24.13,26.16 25.15,27.18 v2(25.65,27.18)
  Bottom Layer w0.203: CN8.4 10.41,36.75
PD1: length 22.3
  Top Layer w0.203: v2(25.14,26.37) 25.1,26.37 24.06,25.33 24.05,25.33
  Inner1 w0.203: v2(10.54,35.95) 11.55,35.95 21.72,25.78 24.51,25.78 25.1,26.37 v2(25.14,26.37)
  Bottom Layer w0.203: CN8.6 v2(10.54,35.95)
PD2: length 23.4
  Top Layer w0.203: v2(25.78,25.87) 25.36,25.87 24.47,24.98 24.41,24.98
  Inner1 w0.203: v2(10.54,35.18) 11.66,35.18 21.41,25.43 23.47,25.43 24,24.89 24.41,24.89 25.39,25.87 v2(25.78,25.87)
  Bottom Layer w0.203: CN8.8 10.51,35.15 v2(10.54,35.18)
PD3: length 19.7
  Top Layer w0.203: 24.24,24.12 24.24,24.08 24.21,24.05 23.76,24.05 23.54,24.26 23.32,24.26 ; 23.32,24.27 22.88,24.71
  Inner1 w0.203: 22.78,24.65 21.57,24.65 11.88,34.34 v2(10.54,34.34)
  Bottom Layer w0.203: CN8.10 v2(10.54,34.34)
  vias: v2(22.78,24.66)
PD4: length 20.8
  Top Layer w0.203: U1.85 25.11,24.19 24.67,23.75 24.54,23.75 24.48,23.69 23.4,23.69 v2(23.33,23.75)
  Inner1 w0.203: v2(23.33,23.75) 22.96,23.75 22.76,23.96 21.51,23.96 11.81,33.66 v2(10.24,33.66)
  Bottom Layer w0.203: CN8.12 8.94,33.68 10.21,33.68 v2(10.24,33.66)
PD5: length 21.1
  Top Layer w0.203: U1.86 24.79,23.25 23.07,23.25 22.87,23.45 21.25,23.45 v2(21.19,23.51)
  Inner1 w0.203: v2(21.19,23.51) 21.07,23.51 11.62,32.96 v2(11.26,32.96)
  Bottom Layer w0.203: v2(11.26,32.96) 9.02,32.96 CN8.14
PD6: length 21.1
  Top Layer w0.203: v2(22.12,22.92) 22.13,22.91 25.16,22.91 25.82,23.57
  Inner1 w0.203: v2(10.41,31.88) 11.81,31.88 20.83,22.86 22.06,22.86 v2(22.12,22.92)
  Bottom Layer w0.203: v2(10.41,31.88) 10.35,31.95 CN8.16
PD7: length 21.4
  Top Layer w0.203: U1.88 25.27,22.31 22.94,22.31 v2(22.91,22.34)
  Inner1 w0.203: v2(22.91,22.34) 20.46,22.34 11.75,31.05 v2(11.16,31.05)
  Bottom Layer w0.203: CN8.18 11.07,31.15 v2(11.16,31.05)
PD8: length 27.5
  Top Layer w0.203: 29,36.72 27.81,37.91 v2(27.81,38.1)
  Inner1 w0.203: v2(5.84,36.7) 9.02,39.88 9.02,40.01 9.16,40.15 25.76,40.15 v2(27.81,38.1)
  Bottom Layer w0.203: CN8.3 5.67,36.75 5.72,36.7
PD9: length 27.2
  Top Layer w0.203: U1.56 28.65,36.46 v2(26.75,38.35)
  Inner1 w0.203: v2(5.84,35.95) 9.52,39.62 25.36,39.62 26.63,38.35 v2(26.75,38.35)
  Bottom Layer w0.203: CN8.5 v2(5.84,35.95)
PD10: length 26.8
  Top Layer w0.203: v2(27.18,37.21) 27.18,37.13 U1.57
  Inner1 w0.203: v2(27.18,37.21) 26.42,37.97 25.57,37.97 24.55,38.99 9.91,38.99 v2(6.06,35.15)
  Bottom Layer w0.203: CN8.7 v2(6.06,35.15)
PD11: length 37.7
  Top Layer w0.203: U2.5 17.86,41.4 v2(18.23,41.4) ; v2(19.3,42.67) 21.59,42.67 v2(25.78,38.48) 26.37,37.89 26.37,37.59 26.67,37.29 26.67,36.93 U1.58
  Inner1 w0.203: v2(18.23,41.4) 18.23,41.6 v2(19.3,42.67) ; v2(24,38.35) 10.49,38.35 v2(6.48,34.34)
  Inner2 w0.203: v2(24,38.35) 25.65,38.35 v2(25.78,38.48)
  Bottom Layer w0.203: CN8.9 v2(6.48,34.34)
PD12: length 31.8
  Top Layer w0.203: U1.59 26.92,35.97 26.92,36.2 26.16,36.96 v2(26.16,37.08) ; 16.94,35.79 16.93,35.79 15.96,36.76 15.96,37.92
  Inner2 w0.203: v2(6.1,33.55) 8.91,33.55 9.91,34.54 9.91,36.91 10.46,37.47 12.95,37.47 14.99,35.43 16.13,35.43 16.15,35.46 16.61,35.46 19,37.85 25.4,37.85 v2(26.16,37.08)
  Bottom Layer w0.203: CN8.11 v2(6.1,33.55)
  vias: v2(16.9,35.78)
PD13: length 40.9
  Top Layer w0.203: U1.60 26.29,35.9 ; 26.21,36.06 24.49,37.79 23.5,37.79 21.23,40.05 21.23,41.06 20.52,41.77 20.5,41.77 ; v2(16.21,43.32) 15.83,42.94 15.83,42.01
  Inner2 w0.203: v2(26.29,35.94) 24.89,37.34 22.86,37.34 19.18,33.66 11.05,33.66 10.21,32.82 6.42,32.82 v2(6.35,32.75)
  Bottom Layer w0.203: 20.43,41.9 19.81,42.52 19.81,42.88 19.37,43.32 16.14,43.32 ; CN8.13 v2(6.35,32.75)
  vias: v2(20.45,41.92)
PD14: length 25.1
  Top Layer w0.203: v2(25.15,36.2) 25.28,36.2 U1.61
  Inner2 w0.203: v2(25.15,36.2) 24.89,36.45 23.24,36.45 20.02,33.22 12.25,33.22 11.46,32.44 10.22,32.44 9.72,31.95 v2(6.48,31.95)
  Bottom Layer w0.203: CN8.15 v2(6.48,31.95)
PD15: length 24.3
  Top Layer w0.203: v2(25.4,35.31) 25.46,35.31 U1.62
  Inner2 w0.203: v2(6.48,31.12) 10.46,31.12 11.09,31.75 19.24,31.75 22.8,35.31 v2(25.4,35.31)
  Bottom Layer w0.203: v2(6.48,31.12) 5.03,31.12 5,31.15 CN8.17
PE0: length 24.2
  Top Layer w0.203: v2(27.69,18.42) 27.74,18.42 U1.97
  Inner1 w0.203: v2(10.67,24.75) 12.59,24.75 19.3,18.03 27.31,18.03 v2(27.69,18.42)
  Bottom Layer w0.203: CN8.34 v2(10.67,24.75)
PE1: length 24.5
  Top Layer w0.203: v2(27.69,17.53) 29.71,19.55 29.71,19.68
  Inner1 w0.203: v2(27.69,17.53) 19.06,17.53 12.64,23.95 v2(10.67,23.95)
  Bottom Layer w0.203: CN8.36 v2(10.67,23.95)
PE2: length 27.7
  Top Layer w0.203: 32.13,18.59 32.53,19 32.63,19 ; 16.63,38.03 16.63,37.47 v1(17.02,37.08)
  Bottom Layer w0.203: 23.96,29.56 21.84,31.68 20.94,31.68 20.65,31.98 20.65,33.17 17.79,36.03 17.79,36.53 17.07,37.25 ; 23.96,29.56 23.92,29.56 ; 23.96,29.56 24.69,29.56 25.18,29.08 ; 25.21,29.11 31.79,22.53 31.79,19 32.18,18.61 32.18,18.57
  vias: v2(32.15,18.59)
PE3: length 32.6
  Top Layer w0.203: 36.61,17.12 35.15,17.12 33.14,19.12
  Inner2 w0.203: v2(61.02,23.03) 54.81,16.82 49.68,16.82 49.48,17.02 36.78,17.02 36.7,17.1
  Bottom Layer w0.203: 62.32,23 62.32,22.99 61,22.99
  vias: v2(36.71,17.11)
PE4: length 29.3
  Top Layer w0.203: v2(36.17,17.63) 35.38,17.63 33.7,19.31
  Inner1 w0.203: 56.43,22.99 56.12,22.99 55.4,22.26 55.4,19.51 53.64,17.75
  Inner2 w0.203: 36.21,17.68 36.28,17.62 49.36,17.62 49.68,17.94 50.14,17.94 50.4,17.68 50.56,17.68 50.84,17.95 ; 50.83,17.97 50.97,17.97 51.08,18.09 51.54,18.09 51.83,17.8 v2(53.66,17.8)
  Bottom Layer w0.203: 56.44,23.02 57.95,23.02 57.98,23.05
  vias: v2(56.44,23.01)
PE5: length 30.8
  Top Layer w0.203: 35.56,18.27 35.46,18.27 34.15,19.57
  Inner2 w0.203: v2(61.04,23.81) 60.64,23.81 55.46,18.63 36.64,18.63 36.29,18.28 35.87,18.28 35.84,18.32 35.62,18.32
  Bottom Layer w0.203: 62.1,23.92 62.01,23.82 61.03,23.82
  vias: v2(35.58,18.27)
PE6: length 26.1
  Top Layer w0.203: v2(36.08,18.79) 35.61,18.79 34.46,19.94
  Inner2 w0.203: 36.21,18.82 36.82,19.43 51.93,19.43 v2(56.21,23.71)
  Bottom Layer w0.203: v2(56.21,23.71) 58.01,23.71 58.14,23.84
PE7: length 27.1
  Top Layer w0.203: v2(31.05,32.37) 31.17,32.25 35.99,32.25 36.82,33.08 ; USART3.3 v1(24.38,48.77)
  Inner2 w0.203: 31.07,32.39 30.78,32.39 29.69,33.49 29.69,37.55 24.44,42.8 24.44,48.88
PE8: length 25
  Top Layer w0.203: USART3.2 v1(25.4,48.77) ; 31.96,32.95 35.97,32.95 36.61,33.59
  Inner2 w0.203: 31.89,32.9 30.31,34.48 30.31,37.96 25.36,42.9 25.36,48.83
  vias: v2(31.96,32.97)
PE9: length 29.9
  Top Layer w0.203: 36.89,34.61 39.58,37.3 39.58,37.32 40.34,38.08 41.81,38.08
  Inner1 w0.203: 60.81,30.97 60.35,30.97 54.49,36.83 47.75,36.83 46.47,38.11 41.74,38.11
  Bottom Layer w0.203: 60.98,30.99 61,30.97 62.44,30.97
  vias: v2(41.77,38.1) v2(60.9,30.99)
PE10: length 31.7
  Top Layer w0.203: v2(43.34,38.75) 43.21,38.88 40.48,38.88 36.54,34.94
  Inner1 w0.203: v2(60.88,31.86) 60.33,31.86 53.31,38.88 51.43,38.88 50.02,37.47 47.87,37.47 46.62,38.71 43.32,38.71
  Bottom Layer w0.203: 60.86,31.91 60.89,31.89 62.52,31.89
PE11: length 32
  Top Layer w0.203: 36.06,35.17 40.38,39.49 43.32,39.49 v2(43.33,39.48)
  Inner1 w0.203: v2(60.86,32.64) 60.7,32.64 53.9,39.44 50.59,39.44 49.25,38.1 47.96,38.1 46.59,39.46 43.39,39.46
  Bottom Layer w0.203: v2(60.86,32.64) 60.9,32.68 62.33,32.68
PE12: length 32.1
  Top Layer w0.203: 35.73,35.66 40.29,40.22 42.52,40.22
  Inner1 w0.203: v2(60.79,33.48) 54.09,40.18 50.14,40.18 48.67,38.71 48.14,38.71 46.63,40.22 43.65,40.22 43.65,40.21 43.23,40.21 43.22,40.22 42.56,40.22
  Bottom Layer w0.203: 61.96,33.47 60.86,33.47 60.81,33.52
  vias: v2(42.56,40.19)
PE13: length 32.5
  Top Layer w0.203: v2(43.44,40.72) 43.31,40.84 40.28,40.84 35.44,36.01
  Inner1 w0.203: 43.41,40.75 46.94,40.75 47.68,40.01 48.58,40.01 49.32,40.75 54.5,40.75 v2(60.75,34.5)
  Bottom Layer w0.203: 62.55,34.33 62.52,34.31 60.94,34.31 v2(60.75,34.5)
PE14: length 32.2
  Top Layer w0.203: 42.22,41.43 40.12,41.43 35.14,36.45
  Inner1 w0.203: v2(60.85,35.34) 54.86,41.33 48.97,41.33 48.28,40.64 48,40.64 47.3,41.33 42.44,41.33
  Bottom Layer w0.203: 62.32,34.96 61.24,34.96 v2(60.85,35.34)
  vias: v2(42.38,41.37)
PE15: length 23.2
  Top Layer w0.203: U1.45 37.21,39.2 37.21,40.31 43.05,46.15 43.05,50.55 42.04,51.56 40.26,51.56 38.84,50.14 U15.12
RST: length 43.9
  Top Layer w0.203: 37.2,23.57 38.42,22.35 39.75,22.35 42.42,19.69 42.42,5.84 41.02,4.44 36.45,4.44 34.8,6.1 31.24,6.1 28.28,9.06 RST1.2 ; v1(27.05,10.92) 27.05,12.47 C34.2
  Bottom Layer w0.203: v1(27.05,10.92) 27.05,10.16 v1(28.96,8.26)
VREF: length 17.1
  Top Layer w0.254: 43.8,13.78 43.8,14.57 42.99,15.38 42.99,16.39 43.8,17.2 43.8,17.39 ; U1.20 43.8,21.22 43.8,17.39 ; 43.8,17.39 R1.1 ; 43.8,17.39 46.28,17.39 46.29,17.38
$1N918: length 2.8
  Top Layer w0.203: 22.18,30.82 21.91,31.09 21.39,31.09 ; 20.47,32.35 20.91,32.35 21.15,32.11
  Inner1 w0.203: 21.25,31.07 21.25,32 21.1,32.14
  vias: v2(21.15,32.19) v2(21.32,31.05)
$1N1054: length 12.5
  Top Layer w0.203: U1.48 34.8,38.91 34.8,39.37 31.5,42.67 31.5,43.05 30.86,43.69 C44.2
$1N2797: length 7.7
  Top Layer w0.203: 13.62,16.93 13.35,17.2 9.29,13.14 7.68,13.14
$1N2798: length 3.6
  Top Layer w0.203: USB1.10 10.42,10.06 R19.1
$1N2817: length 1.3
  Top Layer w0.203: 9.32,18.72 9.28,18.69 8.8,18.69 8.67,18.82 8.11,18.82
$1N3550: length 8.5
  Top Layer w0.203: RST1.1 28.28,6.65 27.6,7.33 27.6,10.5 27.9,10.8 28.81,10.8 R13.1
$1N3557: length 2.7
  Top Layer w0.203: R18.2 34.16,13.3 LED2.1
$1N3560: length 1.4
  Top Layer w0.203: LED3.1 15.33,15.73 R11.2
$1N8893: length 3.7
  Bottom Layer w0.254: U9.1 45.67,47.07 R23.2 ; 45.36,45.23 45.36,47.04
$1N8978: length 2.4
  Bottom Layer w0.203: 49.68,48.96 48.81,49.83 U9.3
$1N9785: length 4.8
  Top Layer w0.203: 485.1 63.54,15.2 66.03,12.71
$1N9790: length 19
  Top Layer w0.203: 62.3,11.54 62.3,12.91 61.54,13.67 59.19,13.67 57.99,12.46 ; CN6.2 58.25,3.94 59.13,4.81 59.33,4.81 59.66,4.49 59.86,4.49 60.73,5.36 60.73,5.56 60.41,5.89 60.41,6.09 R29.1 62.23,9.55 62.23,11.06 485.7
$1N9792: length 17.3
  Top Layer w0.203: R26.1 58.93,12.02 58.93,12.07 59.44,12.57 60.71,12.57 61,12.28 485.6 61.23,10.86 R25.2 57.98,5.46 54.74,5.46 53.87,4.59 CN6.1
$1N9796: length 10.1
  Top Layer w0.203: R27.2 66.93,15.26 Q2.3 66.93,16.26 66.29,16.89 65.53,16.89 64.5,17.92 62.5,17.92 62.36,17.78 62.36,16.6 485.2 485.3
$1N9798: length 13.9
  Top Layer w0.203: Q2.1 67.88,18.86 67.44,19.3 62.86,19.3 61.48,17.92 59.33,17.92 58.8,17.4 58.8,15.25 R21.1
$1N10023: length 12.3
  Top Layer w0.203: CAN.2 52.45,14.35 52.96,13.84 54.61,13.84 54.75,13.99 54.75,15.13 55.44,15.81 C50.2 56.58,15.81 57.02,15.37 57.02,12.32 C51.1
$1N10026: length 12
  Top Layer w0.305: CN7.2 48.49,8.9 R30.2 48.64,9.65 49.4,8.89 51.82,8.89 52.45,9.53 CAN.7
$1N10028: length 13.1
  Top Layer w0.305: CAN.6 51.18,11.56 50.93,11.81 49.53,11.81 48.26,10.54 47.13,10.54 R30.1 46.24,4.18 CN7.1
$1N15655: length 2.8
  Top Layer w0.203: C53.1 34.19,49.64 U15.20
$1N16049: length 15
  Top Layer w0.203: R34.2 39.06,45.11 38.89,44.94 37.89,43.94 35.02,43.94 C54.2 35.43,46.26 U15.1 35.38,46.93 35.38,47.57 37.35,49.54 38.58,49.54 U15.11
$1N16103: length 6.8
  Top Layer w0.203: U15.9 39.24,48.64 40.37,49.77 R33.1 41.11,49.53 41.39,49.53 41.78,49.13 41.78,47.58 R34.1
$1N16107: length 8.1
  Top Layer w0.203: C54.1 36.76,46.18 38.18,46.18 39.38,47.38 39.38,47.89 39.23,48.04 39.23,48.14 ; 39.23,48.14 39.23,48.23 39.26,48.26 R33.2 ; 39.23,48.14 U15.8
$1N16237: length 13.8
  Top Layer w0.203: U15.10 39.23,49.14 39.62,49.53 39.62,50.29 40,50.67 41.66,50.67 42.04,50.29 42.04,49.31 42.29,49.06 42.29,47.37 41.8,46.88 41.8,46.24 41.4,45.85 38.4,45.85 37.49,44.94

## Copper pours and planes (outline as drawn; the poured copper is in the pictures)
3.3V on Top Layer: 14.68,13.55 16.06,13.55 16.06,12.26 16.38,11.94 19.94,11.94 20.45,11.43 22.35,11.43 22.48,11.3 22.48,11.05 22.73,10.8 26.16,10.8 26.42,10.54 26.42,9.4 26.54,9.27 23.11,9.27 22.99,9.14 22.35,9.78 20.19,9.78 19.5,9.09 19.5,4.14 14.73,4.14 14.73,13.46 14.61,13.59 14.64,13.59
+5V on Bottom Layer: 3.05,13.46 6.52,13.46 6.52,9.94 3.05,9.94
GND on Top Layer: -0.54,56.04 70.54,56.04 70.54,0.1 -0.54,0.1
GND on Bottom Layer: -0.04,55.81 70.21,55.81 70.21,0.14 -0.04,0.14
